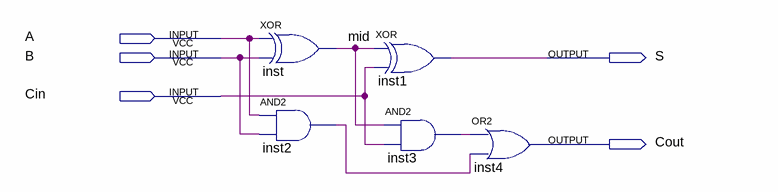
[diagram p0: schematic sheet]
// Quartus schematic lab2_RonnyIsmael.bdf as structural Verilog: 5 symbols, 5 pins
module lab2_RonnyIsmael (
  input  A,
  input  B,
  input  Cin,
  output S,
  output Cout
);

  wire inst2_out, inst3_out, mid;

  xor inst (mid, A, B);
  and inst2 (inst2_out, A, B);
  xor inst1 (S, mid, Cin);
  and inst3 (inst3_out, mid, Cin);
  or inst4 (Cout, inst3_out, inst2_out);
endmodule
